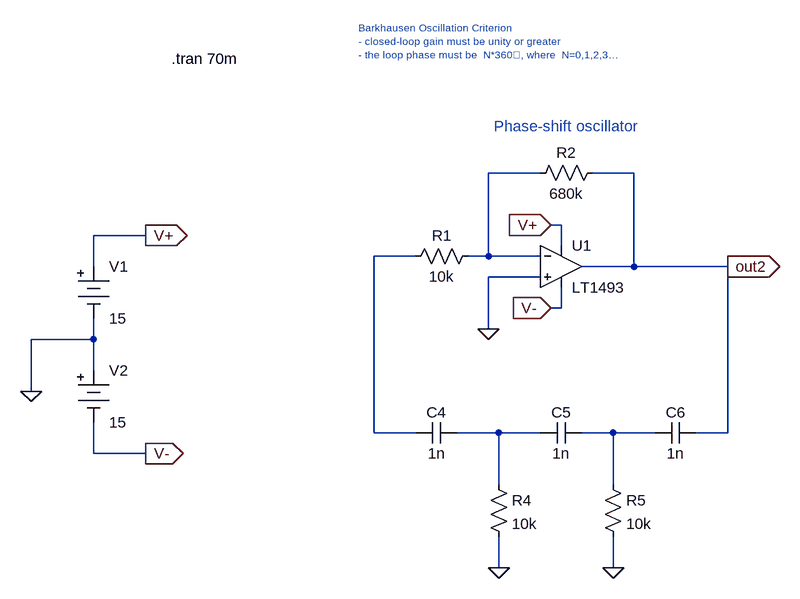
[diagram p0: schematic oscillators.asc]
oscillators.asc, the LTspice schematic file:
Version 4
SHEET 1 1184 1364
WIRE -64 96 -144 96
WIRE 80 96 16 96
WIRE -32 176 -48 176
WIRE -672 192 -752 192
WIRE -32 208 -32 176
WIRE -256 224 -320 224
WIRE -144 224 -144 96
WIRE -144 224 -176 224
WIRE -64 224 -144 224
WIRE -752 240 -752 192
WIRE 80 240 80 96
WIRE 80 240 0 240
WIRE 224 240 80 240
WIRE -64 256 -144 256
WIRE -32 304 -32 272
WIRE -32 304 -48 304
WIRE -144 336 -144 256
WIRE -752 352 -752 320
WIRE -752 352 -848 352
WIRE -752 400 -752 352
WIRE -848 432 -848 352
WIRE -320 496 -320 224
WIRE -256 496 -320 496
WIRE -128 496 -192 496
WIRE -64 496 -128 496
WIRE 48 496 0 496
WIRE 112 496 48 496
WIRE 224 496 224 240
WIRE 224 496 176 496
WIRE -752 528 -752 480
WIRE -672 528 -752 528
WIRE -128 576 -128 496
WIRE 48 576 48 496
WIRE -128 704 -128 656
WIRE 48 704 48 656
FLAG -848 432 0
FLAG -672 192 V+
IOPIN -672 192 Out
FLAG -672 528 V-
IOPIN -672 528 Out
FLAG -144 336 0
FLAG -48 176 V+
IOPIN -48 176 In
FLAG -48 304 V-
IOPIN -48 304 In
FLAG -128 704 0
FLAG 48 704 0
FLAG 224 240 out2
IOPIN 224 240 Out
SYMBOL Misc\\battery -752 224 R0
WINDOW 123 0 0 Left 0
WINDOW 39 0 0 Left 0
SYMATTR InstName V1
SYMATTR Value 15
SYMBOL Misc\\battery -752 384 R0
WINDOW 123 0 0 Left 0
WINDOW 39 0 0 Left 0
SYMATTR InstName V2
SYMATTR Value 15
SYMBOL res -160 208 R90
WINDOW 0 0 56 VBottom 2
WINDOW 3 32 56 VTop 2
SYMATTR InstName R1
SYMATTR Value 10k
SYMBOL res 32 80 R90
WINDOW 0 0 56 VBottom 2
WINDOW 3 32 56 VTop 2
SYMATTR InstName R2
SYMATTR Value 680k
SYMBOL OpAmps\\LT1493 -32 176 R0
SYMATTR InstName U1
SYMBOL cap -192 480 R90
WINDOW 0 0 32 VBottom 2
WINDOW 3 32 32 VTop 2
SYMATTR InstName C4
SYMATTR Value 1n
SYMBOL cap 0 480 R90
WINDOW 0 0 32 VBottom 2
WINDOW 3 32 32 VTop 2
SYMATTR InstName C5
SYMATTR Value 1n
SYMBOL cap 176 480 R90
WINDOW 0 0 32 VBottom 2
WINDOW 3 32 32 VTop 2
SYMATTR InstName C6
SYMATTR Value 1n
SYMBOL res -144 560 R0
SYMATTR InstName R4
SYMATTR Value 10k
SYMBOL res 32 560 R0
SYMATTR InstName R5
SYMATTR Value 10k
TEXT -632 -80 Left 2 !.tran 70m
TEXT -344 -128 Left 1 ;Barkhausen Oscillation Criterion\n- closed-loop gain must be unity or greater\n- the loop phase must be  N*360∘, where  N=0,1,2,3…
TEXT -136 24 Left 2 ;Phase-shift oscillator

The netlist it stands for:
* oscillators.asc
V1 V+ 0 15
V2 0 V- 15
R1 N001 N002 10k
R2 out2 N001 680k
XU1 0 N001 V+ V- out2 LT1493  ; pins In+ In- V+ V- OUT
C4 N003 N002 1n
C5 N004 N003 1n
C6 out2 N004 1n
R4 N003 0 10k
R5 N004 0 10k
.tran 70m
* Barkhausen Oscillation Criterion
* - closed-loop gain must be unity or greater
* - the loop phase must be  N*360∘, where  N=0,1,2,3…
* Phase-shift oscillator
.backanno
.end